# EasyEDA Pro project ED2025_-07-28_14-39-40.eprj

# Schematic Schematic1
Board Name: Board1; Create Date: 2025-07-28; Page Name: P1; Project Name: ED2025_-07-28_14-39-40; Schematic Name: Schematic1; Update Date: 2025-07-28; Company: 嘉立创EDA; Page Size: A4; Version: V1.0
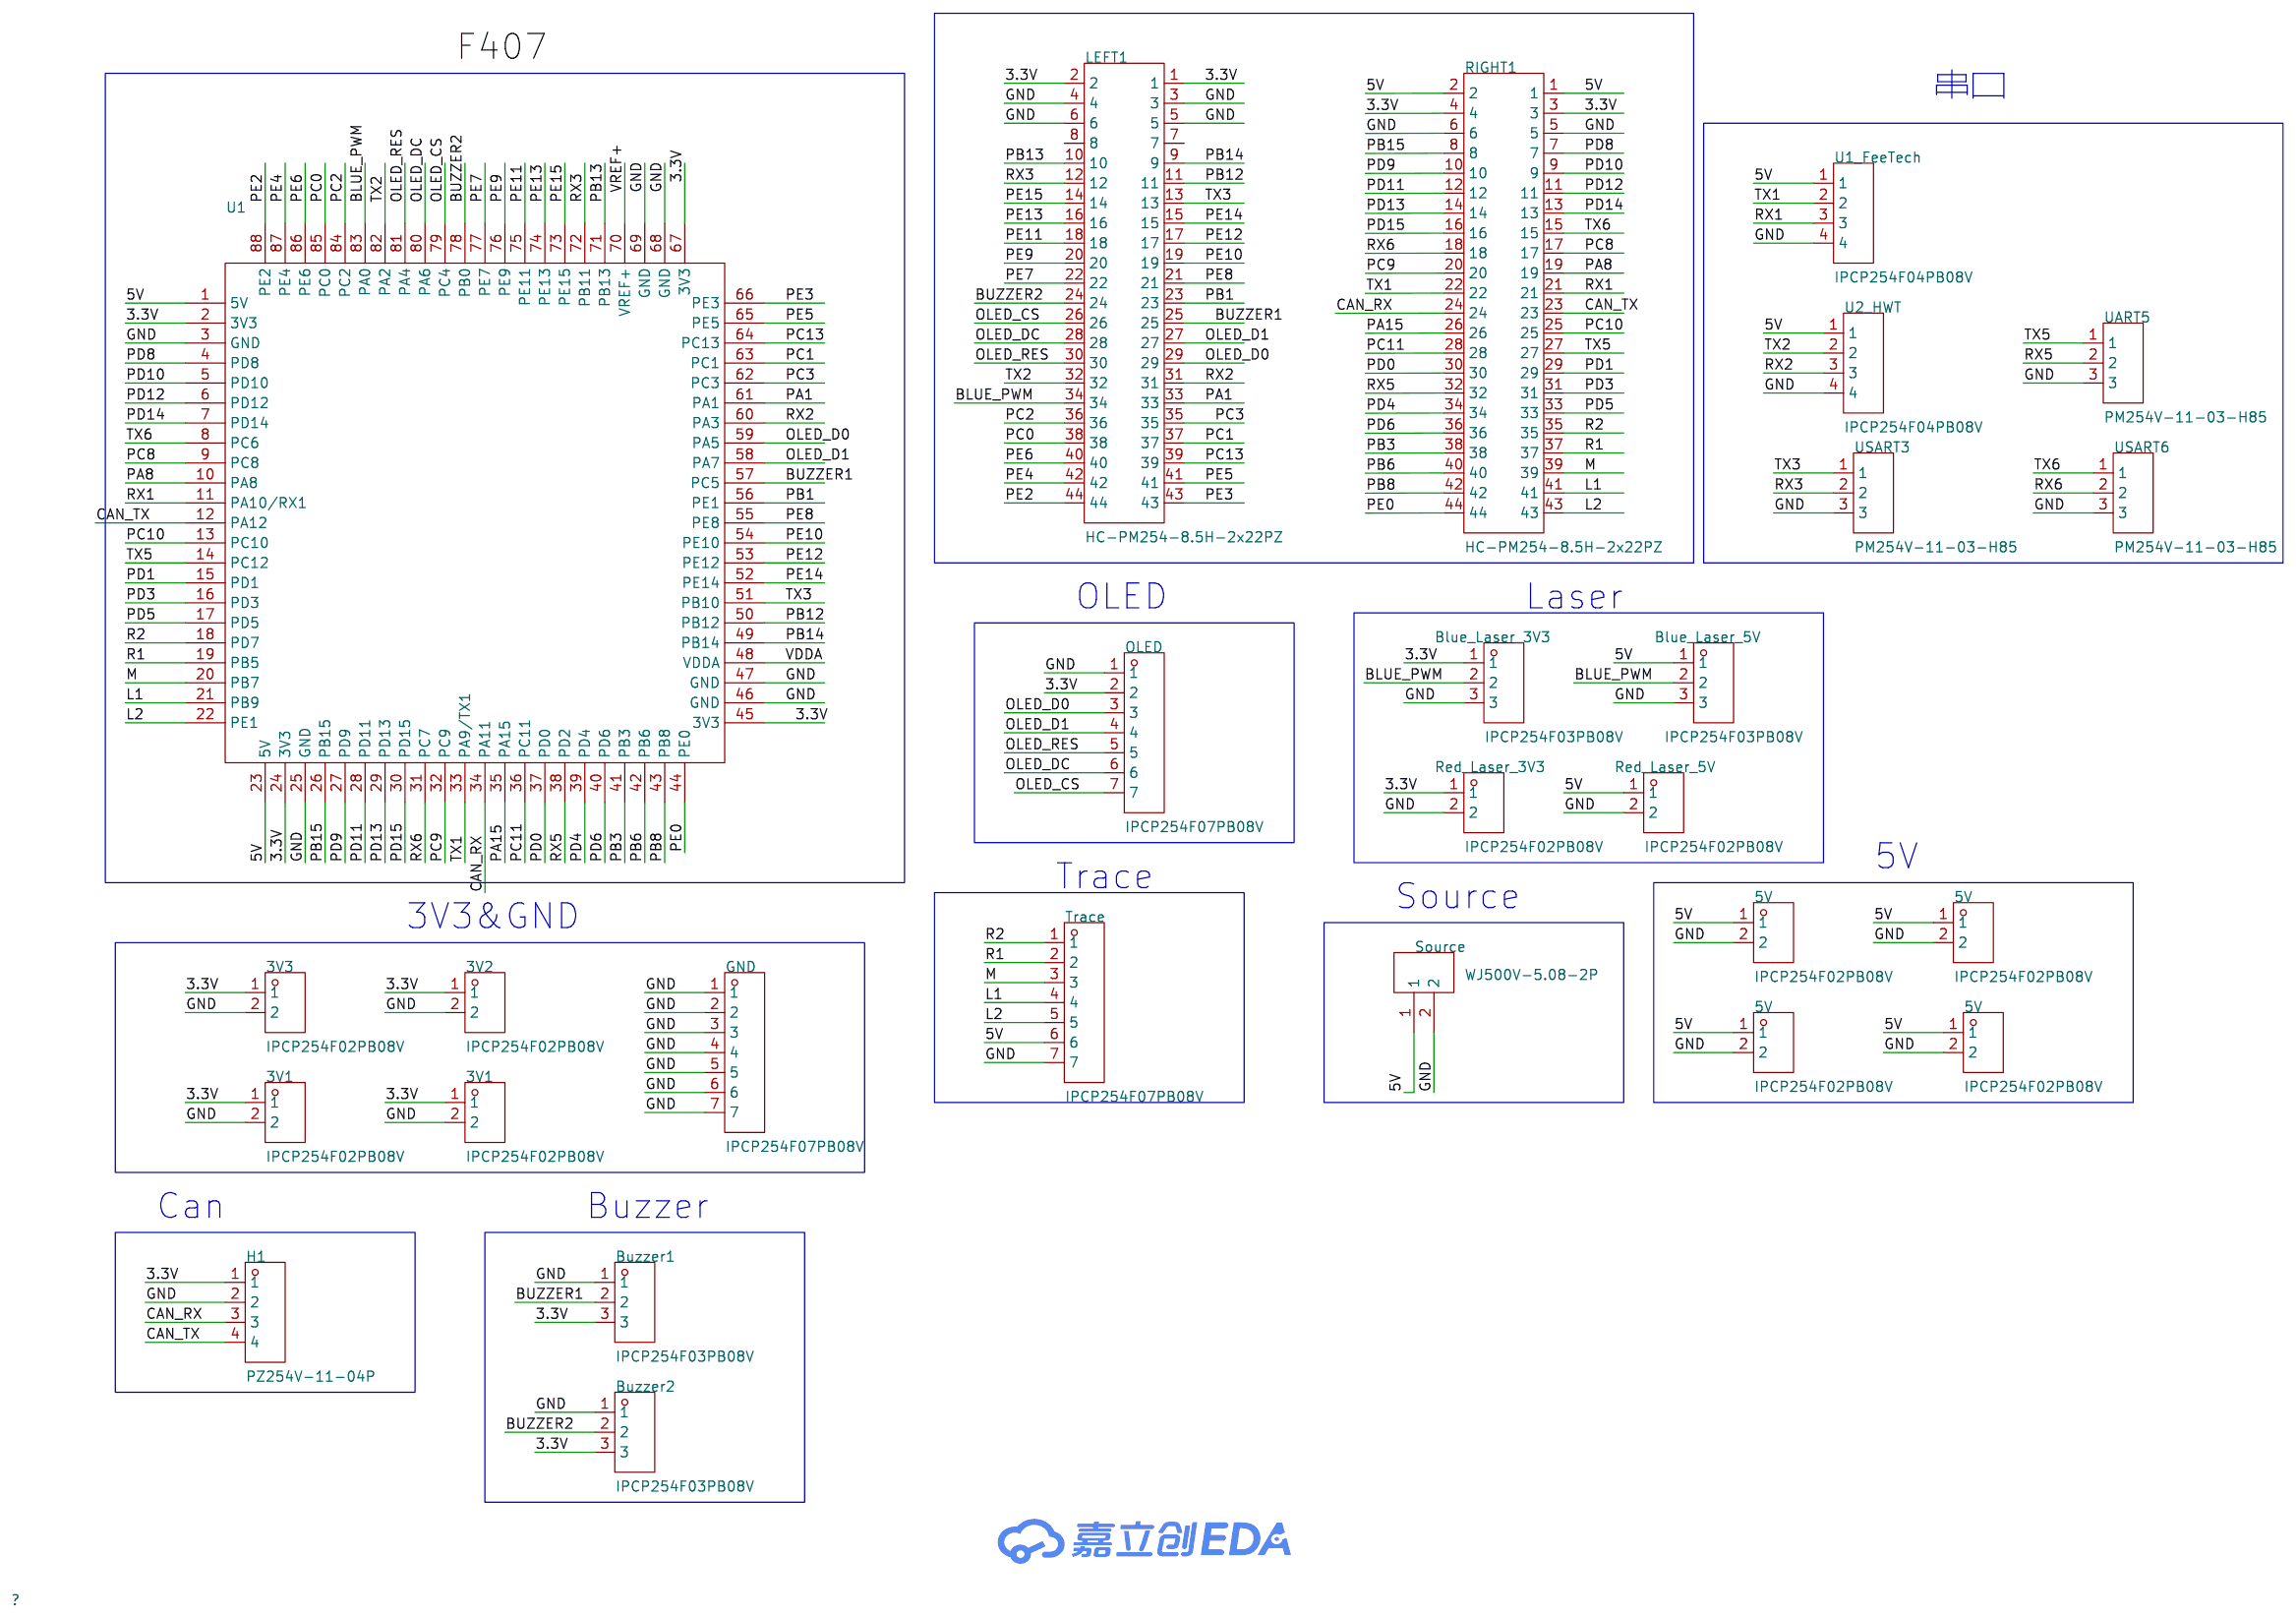
[diagram p0: schematic sheet]

## Parts
3V1  IPCP254F02PB08V  [CONN-TH_IPCP254F02PB08V]
3V1#2  IPCP254F02PB08V  [CONN-TH_IPCP254F02PB08V]
3V2  IPCP254F02PB08V  [CONN-TH_IPCP254F02PB08V]
3V3  IPCP254F02PB08V  [CONN-TH_IPCP254F02PB08V]
5V  IPCP254F02PB08V  [CONN-TH_IPCP254F02PB08V]
5V#2  IPCP254F02PB08V  [CONN-TH_IPCP254F02PB08V]
5V#3  IPCP254F02PB08V  [CONN-TH_IPCP254F02PB08V]
5V#4  IPCP254F02PB08V  [CONN-TH_IPCP254F02PB08V]
Blue_Laser_3V3  IPCP254F03PB08V  [HDR-TH_3P-P2.54-V-F-1]
Blue_Laser_5V  IPCP254F03PB08V  [HDR-TH_3P-P2.54-V-F-1]
Buzzer1  IPCP254F03PB08V  [HDR-TH_3P-P2.54-V-F-1]
Buzzer2  IPCP254F03PB08V  [HDR-TH_3P-P2.54-V-F-1]
GND  IPCP254F07PB08V  [HDR-TH_7P-P2.54-V-F]
H1  PZ254V-11-04P  [HDR-TH_4P-P2.54-V-M]
LEFT1  HC-PM254-8.5H-2x22PZ  [HDR-TH_44P-P2.54-V-F-R2-C22-S2.54]
OLED  IPCP254F07PB08V  [HDR-TH_7P-P2.54-V-F]
Red_Laser_3V3  IPCP254F02PB08V  [CONN-TH_IPCP254F02PB08V]
Red_Laser_5V  IPCP254F02PB08V  [CONN-TH_IPCP254F02PB08V]
RIGHT1  HC-PM254-8.5H-2x22PZ  [HDR-TH_44P-P2.54-V-F-R2-C22-S2.54]
Source  WJ500V-5.08-2P  [CONN-TH_2P-P5.00_WJ500V-5.08-2P]
Trace  IPCP254F07PB08V  [HDR-TH_7P-P2.54-V-F]
U1  -  [STM32F4XX最小系统板]
U1_FeeTech  IPCP254F04PB08V  [HDR-TH_4P-IPCP254F04PB08V]
U2_HWT  IPCP254F04PB08V  [HDR-TH_4P-IPCP254F04PB08V]
UART5  PM254V-11-03-H85  [HDR-TH_3P-P2.54-V-F]
USART3  PM254V-11-03-H85  [HDR-TH_3P-P2.54-V-F]
USART6  PM254V-11-03-H85  [HDR-TH_3P-P2.54-V-F]

## Library data of the parts
3V1 3V1#2 3V2 3V3 5V 5V#2-5V#4 Red_Laser_3V3 Red_Laser_5V = IPCP254F02PB08V: LCSC Part Name: 1x2P 间距:2.54mm 直插; Supplier Part: C22438460; Manufacturer: INCP; Supplier Footprint: 插件,P=2.54mm; JLCPCB Part Class: 扩展库; Datasheet: https://atta.szlcsc.com/upload/public/pdf/source/20240523/6A36805F5B2B6DF79759E177043CFD1C.pdf; Supplier: LCSC; Holes Structure: 1x2P; Pitch: 2.54mm; Circular Hole / Square Hole: 方孔; Mounting Type: 直插; Number of Rows: 单排; Number of Holes: 2P; Current Rating (Max): 3A; Insulation Height: 8.5mm; Contact Material: 黄铜; Contact Plating: 金; Operating Temperature Range: -40℃~+105℃
Blue_Laser_3V3 Blue_Laser_5V Buzzer1 Buzzer2 = IPCP254F03PB08V: LCSC Part Name: 1x3P 间距:2.54mm 直插; Supplier Part: C22438461; Manufacturer: INCP; Supplier Footprint: 插件,P=2.54mm; JLCPCB Part Class: 扩展库; Datasheet: https://atta.szlcsc.com/upload/public/pdf/source/20240523/6A36805F5B2B6DF79759E177043CFD1C.pdf; Supplier: LCSC; Holes Structure: 1x3P; Pitch: 2.54mm; Circular Hole / Square Hole: 方孔; Mounting Type: 直插; Number of Rows: 单排; Number of Holes: 3P; Current Rating (Max): 3A; Insulation Height: 8.5mm; Contact Material: 黄铜; Contact Plating: 金; Operating Temperature Range: -40℃~+105℃
GND OLED Trace = IPCP254F07PB08V: LCSC Part Name: 1x7P 间距:2.54mm 直插; Supplier Part: C22438465; Manufacturer: INCP; Supplier Footprint: 插件,P=2.54mm; JLCPCB Part Class: 扩展库; Datasheet: https://atta.szlcsc.com/upload/public/pdf/source/20240523/6A36805F5B2B6DF79759E177043CFD1C.pdf; Supplier: LCSC; Holes Structure: 1x7P; Pitch: 2.54mm; Circular Hole / Square Hole: 方孔; Mounting Type: 直插; Number of Rows: 单排; Number of Holes: 7P; Current Rating (Max): 3A; Insulation Height: 8.5mm; Contact Material: 黄铜; Contact Plating: 金; Operating Temperature Range: -40℃~+105℃
H1 = PZ254V-11-04P: LCSC Part Name: 间距:2.54mm 1x4P 直插 方针; Supplier Part: C2691448; Manufacturer: XFCN(兴飞); Supplier Footprint: 插件,P=2.54mm; JLCPCB Part Class: 扩展库; Datasheet: https://atta.szlcsc.com/upload/public/pdf/source/20200309/C492403_F9F19131791D08044AD4F84F8E751A34.pdf; Supplier: LCSC; Pin Structure: 1x4P; Pitch: 2.54mm; Circluar Pins/Square Pins: 方针; Mounting Type: 直插; Number of Rows: 单排; Number of Pins: 4P; Current Rating (Max): 3A; Voltage Rating (Max): 250V; Length of Mating Pin: 6mm; Insulation Height: 2.5mm; Length of End Connection Pin: 3mm; Operating Temperature Range: -40℃~+105℃; Color: 黑色
LEFT1 RIGHT1 = HC-PM254-8.5H-2x22PZ: LCSC Part Name: 间距2.54mm 2x22Pin 直插 PC3.0 H8.5; Supplier Part: C27985237; Manufacturer: HC(虹成电子); Supplier Footprint: 插件,P=2.54mm; JLCPCB Part Class: 扩展库; Datasheet: https://atta.szlcsc.com/upload/public/pdf/source/20250106/5A665511CCA213F356EEEBF322FAE788.pdf; Supplier: LCSC; Holes Structure: 2x22P; Pitch: 2.54mm; Row Spacing: 2.54mm; Circular Hole / Square Hole: 方孔; Mounting Type: 直插; Number of Rows: 双排; Number of Positions: 44P; Current Rating: 3A; Holes Direction: 顶部; Insulation Height: 8.5mm; Contact Material: 黄铜; Contact Plating: 金; Operating Temperature: -40℃~+105℃; PIN Length: 3mm
Source = WJ500V-5.08-2P: LCSC Part Name: 1x2P 5.08mm 直插 排数:1 每排P数:2; Supplier Part: C8465; Manufacturer: KANGNEX(康奈克斯电气); Supplier Footprint: 插件,P=5.08mm; JLCPCB Part Class: 扩展库; Datasheet: https://atta.szlcsc.com/upload/public/pdf/source/20191225/C8465_02D34CE5B5B4A53DF5891601D97FA9F4.pdf; Supplier: LCSC; Structure: 1x2P; Pitch: 5.08mm; Color: 绿色; Mounting Style: 直插; Current Rating (Max): 18A; Voltage Rating (Max): 250V; Number of Pins: 2P; Number of Rows: 1; Wire Gauge - AWG: 14~30; Wire Gauge - mm2: 2.5; Number of PINs Per Row: 2; Operating Temperature Range: -40℃~+105℃; Screw Specification: M2.5
U1 = STM32F4xx 最小系统板
U1_FeeTech U2_HWT = IPCP254F04PB08V: LCSC Part Name: 1x4P 间距:2.54mm 直插; Supplier Part: C22438462; Manufacturer: INCP; Supplier Footprint: 插件,P=2.54mm; JLCPCB Part Class: 扩展库; Datasheet: https://atta.szlcsc.com/upload/public/pdf/source/20240523/6A36805F5B2B6DF79759E177043CFD1C.pdf; Supplier: LCSC; Holes Structure: 1x4P; Pitch: 2.54mm; Circular Hole / Square Hole: 方孔; Mounting Type: 直插; Number of Rows: 单排; Number of Positions: 4P; Current Rating: 3A; Insulation Height: 8.5mm; Contact Material: 黄铜; Contact Plating: 金; Operating Temperature: -40℃~+105℃
UART5 USART3 USART6 = PM254V-11-03-H85: LCSC Part Name: 间距:2.54mm 1x3P 直插; Supplier Part: C541850; Manufacturer: XFCN(兴飞); Supplier Footprint: 插件,P=2.54mm; JLCPCB Part Class: 扩展库; Datasheet: https://atta.szlcsc.com/upload/public/pdf/source/20200518/C541849_85853D71FC67C51915A806977A588FDA.pdf; Supplier: LCSC; Holes Structure: 1x3P; Pitch: 2.54mm; Mounting Type: 直插; Number of Rows: 单排; Number of Holes: 3P; Contact Material: 黄铜

## Nets
3.3V: 3V1.1 3V1#2.1 3V2.1 3V3.1 Blue_Laser_3V3.1 Buzzer1.3 Buzzer2.3 H1.1 LEFT1.1 LEFT1.2 OLED.2 Red_Laser_3V3.1 RIGHT1.3 RIGHT1.4 U1.2(3V3) U1.24(3V3) U1.45(3V3) U1.67(3V3)
5V: 5V.1 5V#2.1 5V#3.1 5V#4.1 Blue_Laser_5V.1 Red_Laser_5V.1 RIGHT1.1 RIGHT1.2 Source.1 Trace.6 U1.1(5V) U1.23(5V) U1_FeeTech.1 U2_HWT.1
GND: 3V1.2 3V1#2.2 3V2.2 3V3.2 5V.2 5V#2.2 5V#3.2 5V#4.2 Blue_Laser_3V3.3 Blue_Laser_5V.3 Buzzer1.1 Buzzer2.1 GND.1 GND.2 GND.3 GND.4 GND.5 GND.6 GND.7 H1.2 LEFT1.3 LEFT1.4 LEFT1.5 LEFT1.6 OLED.1 Red_Laser_3V3.2 Red_Laser_5V.2 RIGHT1.5 RIGHT1.6 Source.2 Trace.7 U1.3(GND) U1.25(GND) U1.46(GND) U1.47(GND) U1.68(GND) U1.69(GND) U1_FeeTech.4 U2_HWT.4 UART5.3 USART3.3 USART6.3
VDDA: U1.48(VDDA)
BLUE_PWM: Blue_Laser_3V3.2 Blue_Laser_5V.2 LEFT1.34 U1.83(PA0)
BUZZER1: Buzzer1.2 LEFT1.25 U1.57(PC5)
BUZZER2: Buzzer2.2 LEFT1.24 U1.78(PB0)
CAN_RX: H1.3 RIGHT1.24 U1.34(PA11)
CAN_TX: H1.4 RIGHT1.23 U1.12(PA12)
L1: RIGHT1.41 Trace.4 U1.21(PB9)
L2: RIGHT1.43 Trace.5 U1.22(PE1)
M: RIGHT1.39 Trace.3 U1.20(PB7)
OLED_CS: LEFT1.26 OLED.7 U1.79(PC4)
OLED_D0: LEFT1.29 OLED.3 U1.59(PA5)
OLED_D1: LEFT1.27 OLED.4 U1.58(PA7)
OLED_DC: LEFT1.28 OLED.6 U1.80(PA6)
OLED_RES: LEFT1.30 OLED.5 U1.81(PA4)
PA1: LEFT1.33 U1.61(PA1)
PA8: RIGHT1.19 U1.10(PA8)
PA15: RIGHT1.26 U1.35(PA15)
PB1: LEFT1.23 U1.56(PE1)
PB3: RIGHT1.38 U1.41(PB3)
PB6: RIGHT1.40 U1.42(PB6)
PB8: RIGHT1.42 U1.43(PB8)
PB12: LEFT1.11 U1.50(PB12)
PB13: LEFT1.10 U1.71(PB13)
PB14: LEFT1.9 U1.49(PB14)
PB15: RIGHT1.8 U1.26(PB15)
PC0: LEFT1.38 U1.85(PC0)
PC1: LEFT1.37 U1.63(PC1)
PC2: LEFT1.36 U1.84(PC2)
PC3: LEFT1.35 U1.62(PC3)
PC8: RIGHT1.17 U1.9(PC8)
PC9: RIGHT1.20 U1.32(PC9)
PC10: RIGHT1.25 U1.13(PC10)
PC11: RIGHT1.28 U1.36(PC11)
PC13: LEFT1.39 U1.64(PC13)
PD0: RIGHT1.30 U1.37(PD0)
PD1: RIGHT1.29 U1.15(PD1)
PD3: RIGHT1.31 U1.16(PD3)
PD4: RIGHT1.34 U1.39(PD4)
PD5: RIGHT1.33 U1.17(PD5)
PD6: RIGHT1.36 U1.40(PD6)
PD8: RIGHT1.7 U1.4(PD8)
PD9: RIGHT1.10 U1.27(PD9)
PD10: RIGHT1.9 U1.5(PD10)
PD11: RIGHT1.12 U1.28(PD11)
PD12: RIGHT1.11 U1.6(PD12)
PD13: RIGHT1.14 U1.29(PD13)
PD14: RIGHT1.13 U1.7(PD14)
PD15: RIGHT1.16 U1.30(PD15)
PE0: RIGHT1.44 U1.44(PE0)
PE2: LEFT1.44 U1.88(PE2)
PE3: LEFT1.43 U1.66(PE3)
PE4: LEFT1.42 U1.87(PE4)
PE5: LEFT1.41 U1.65(PE5)
PE6: LEFT1.40 U1.86(PE6)
PE7: LEFT1.22 U1.77(PE7)
PE8: LEFT1.21 U1.55(PE8)
PE9: LEFT1.20 U1.76(PE9)
PE10: LEFT1.19 U1.54(PE10)
PE11: LEFT1.18 U1.75(PE11)
PE12: LEFT1.17 U1.53(PE12)
PE13: LEFT1.16 U1.74(PE13)
PE14: LEFT1.15 U1.52(PE14)
PE15: LEFT1.14 U1.73(PE15)
R1: RIGHT1.37 Trace.2 U1.19(PB5)
R2: RIGHT1.35 Trace.1 U1.18(PD7)
RX1: RIGHT1.21 U1.11(PA10/RX1) U1_FeeTech.3
RX2: LEFT1.31 U1.60(PA3) U2_HWT.3
RX3: LEFT1.12 U1.72(PB11) USART3.2
RX5: RIGHT1.32 U1.38(PD2) UART5.2
RX6: RIGHT1.18 U1.31(PC7) USART6.2
TX1: RIGHT1.22 U1.33(PA9/TX1) U1_FeeTech.2
TX2: LEFT1.32 U1.82(PA2) U2_HWT.2
TX3: LEFT1.13 U1.51(PB10) USART3.1
TX5: RIGHT1.27 U1.14(PC12) UART5.1
TX6: RIGHT1.15 U1.8(PC6) USART6.1
VREF+: U1.70(VREF+)

Not connected (* = marked no-connect by the designer): LEFT1 7 8

## Notes on the sheet
- F407
- 串口
- OLED
- Laser
- 5V
- Trace
- 3V3&GND
- Source
- Can
- Buzzer

# Board PCB1
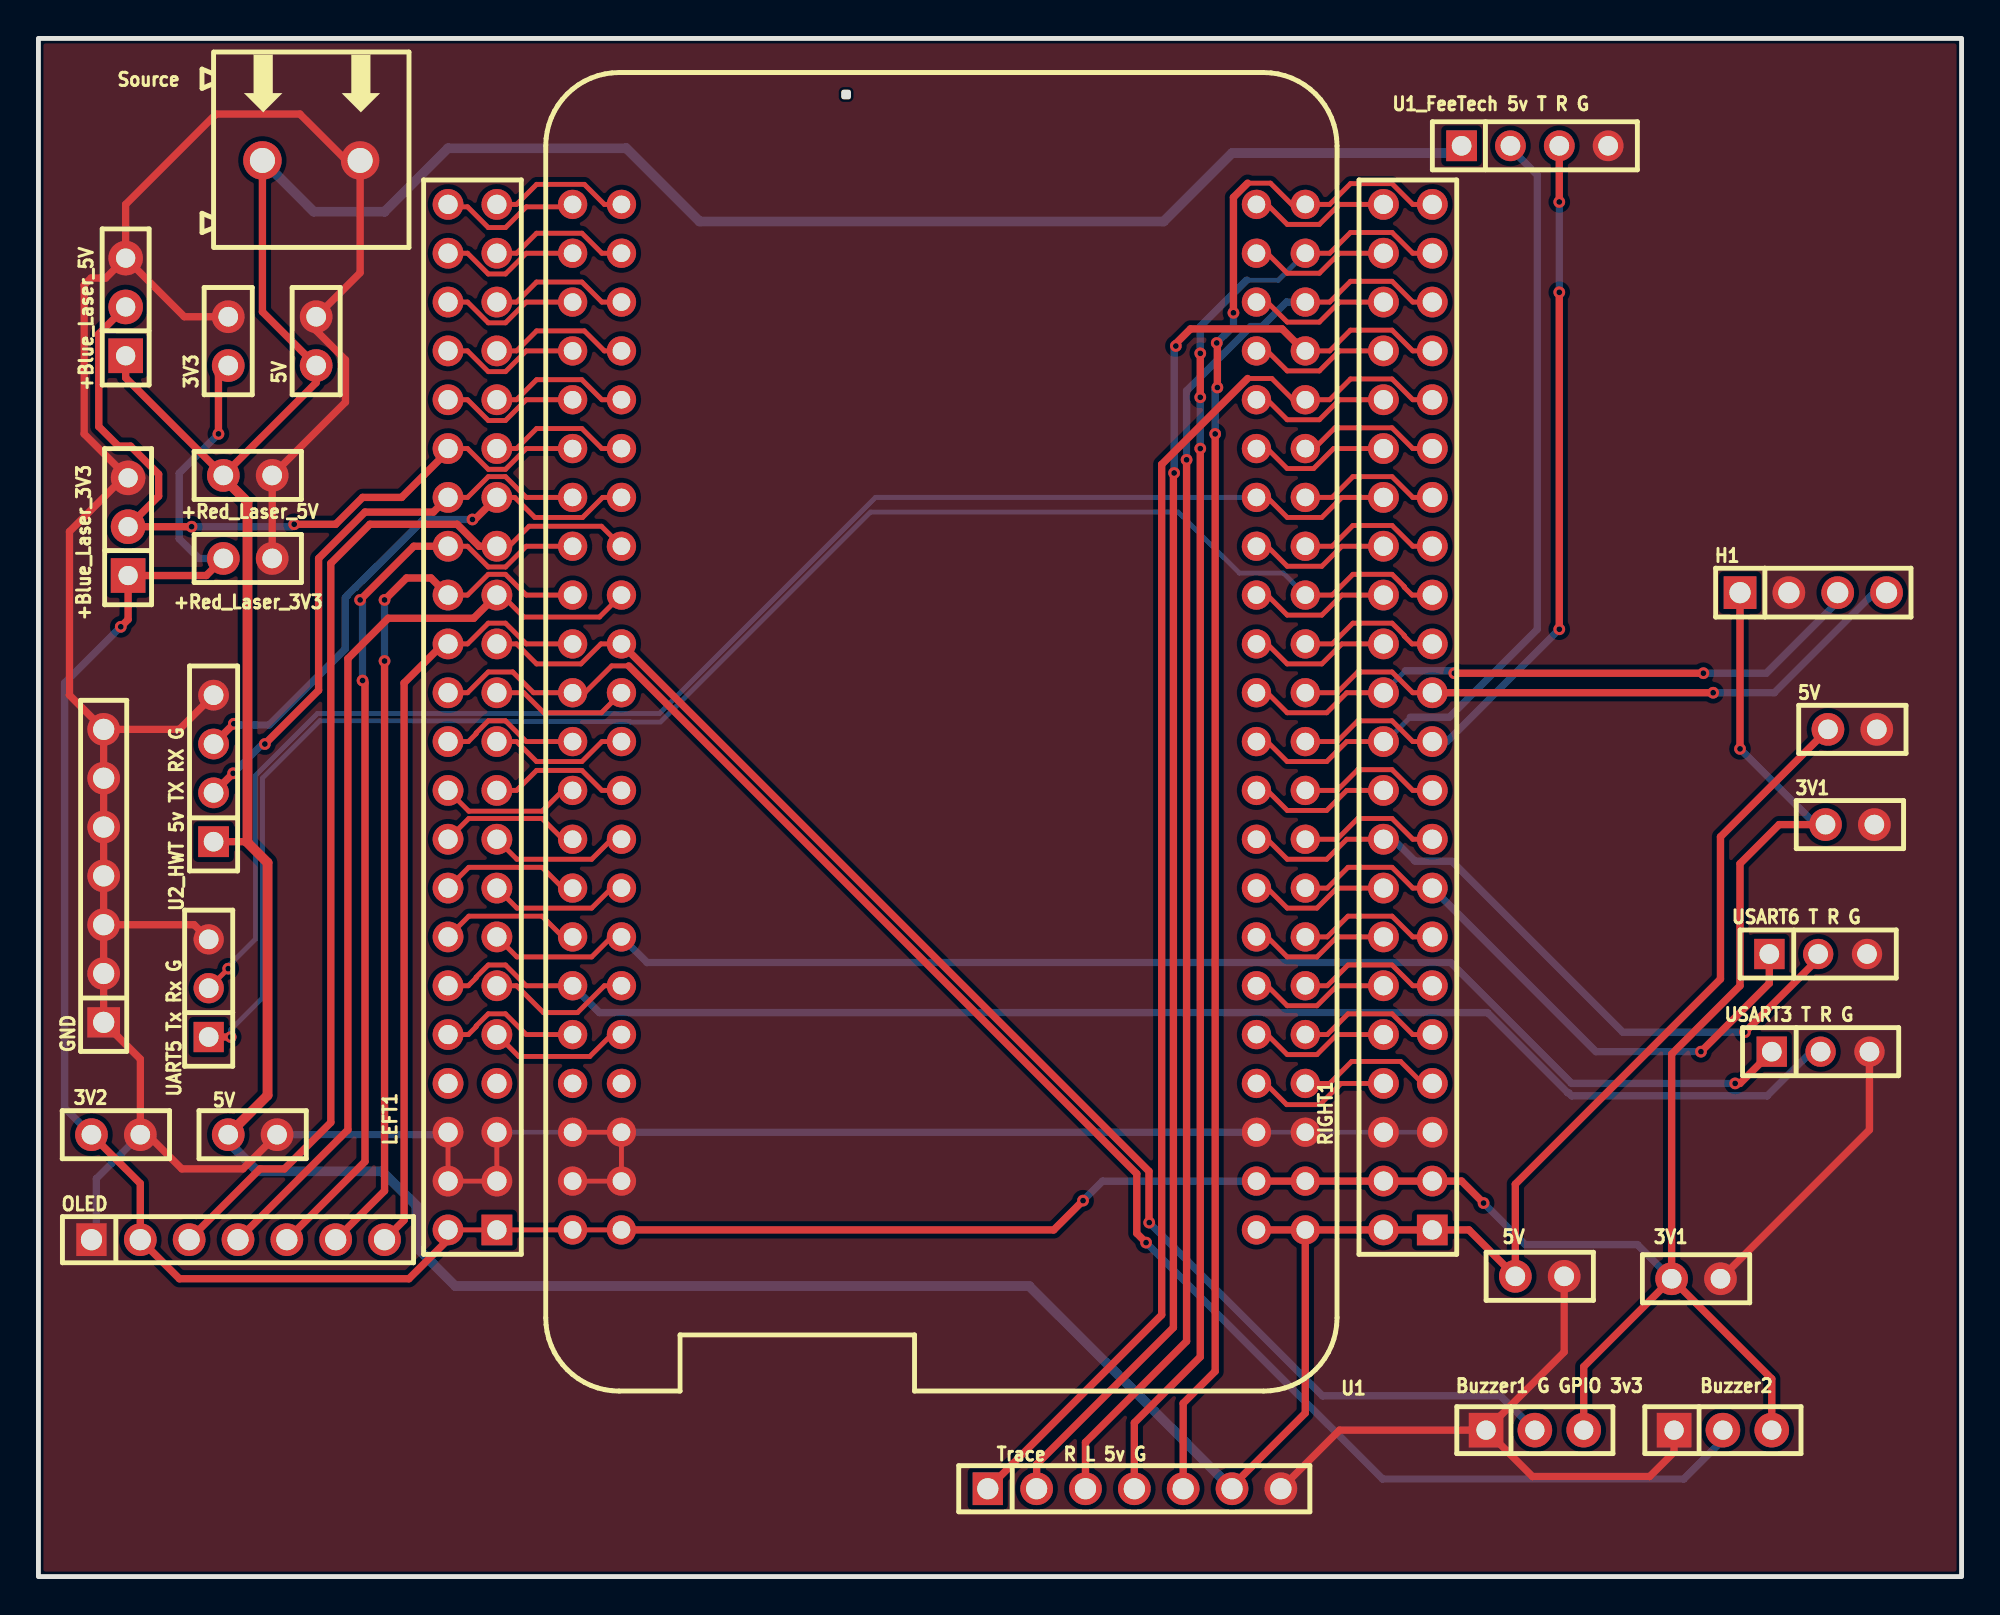
[diagram p1: board, top side]
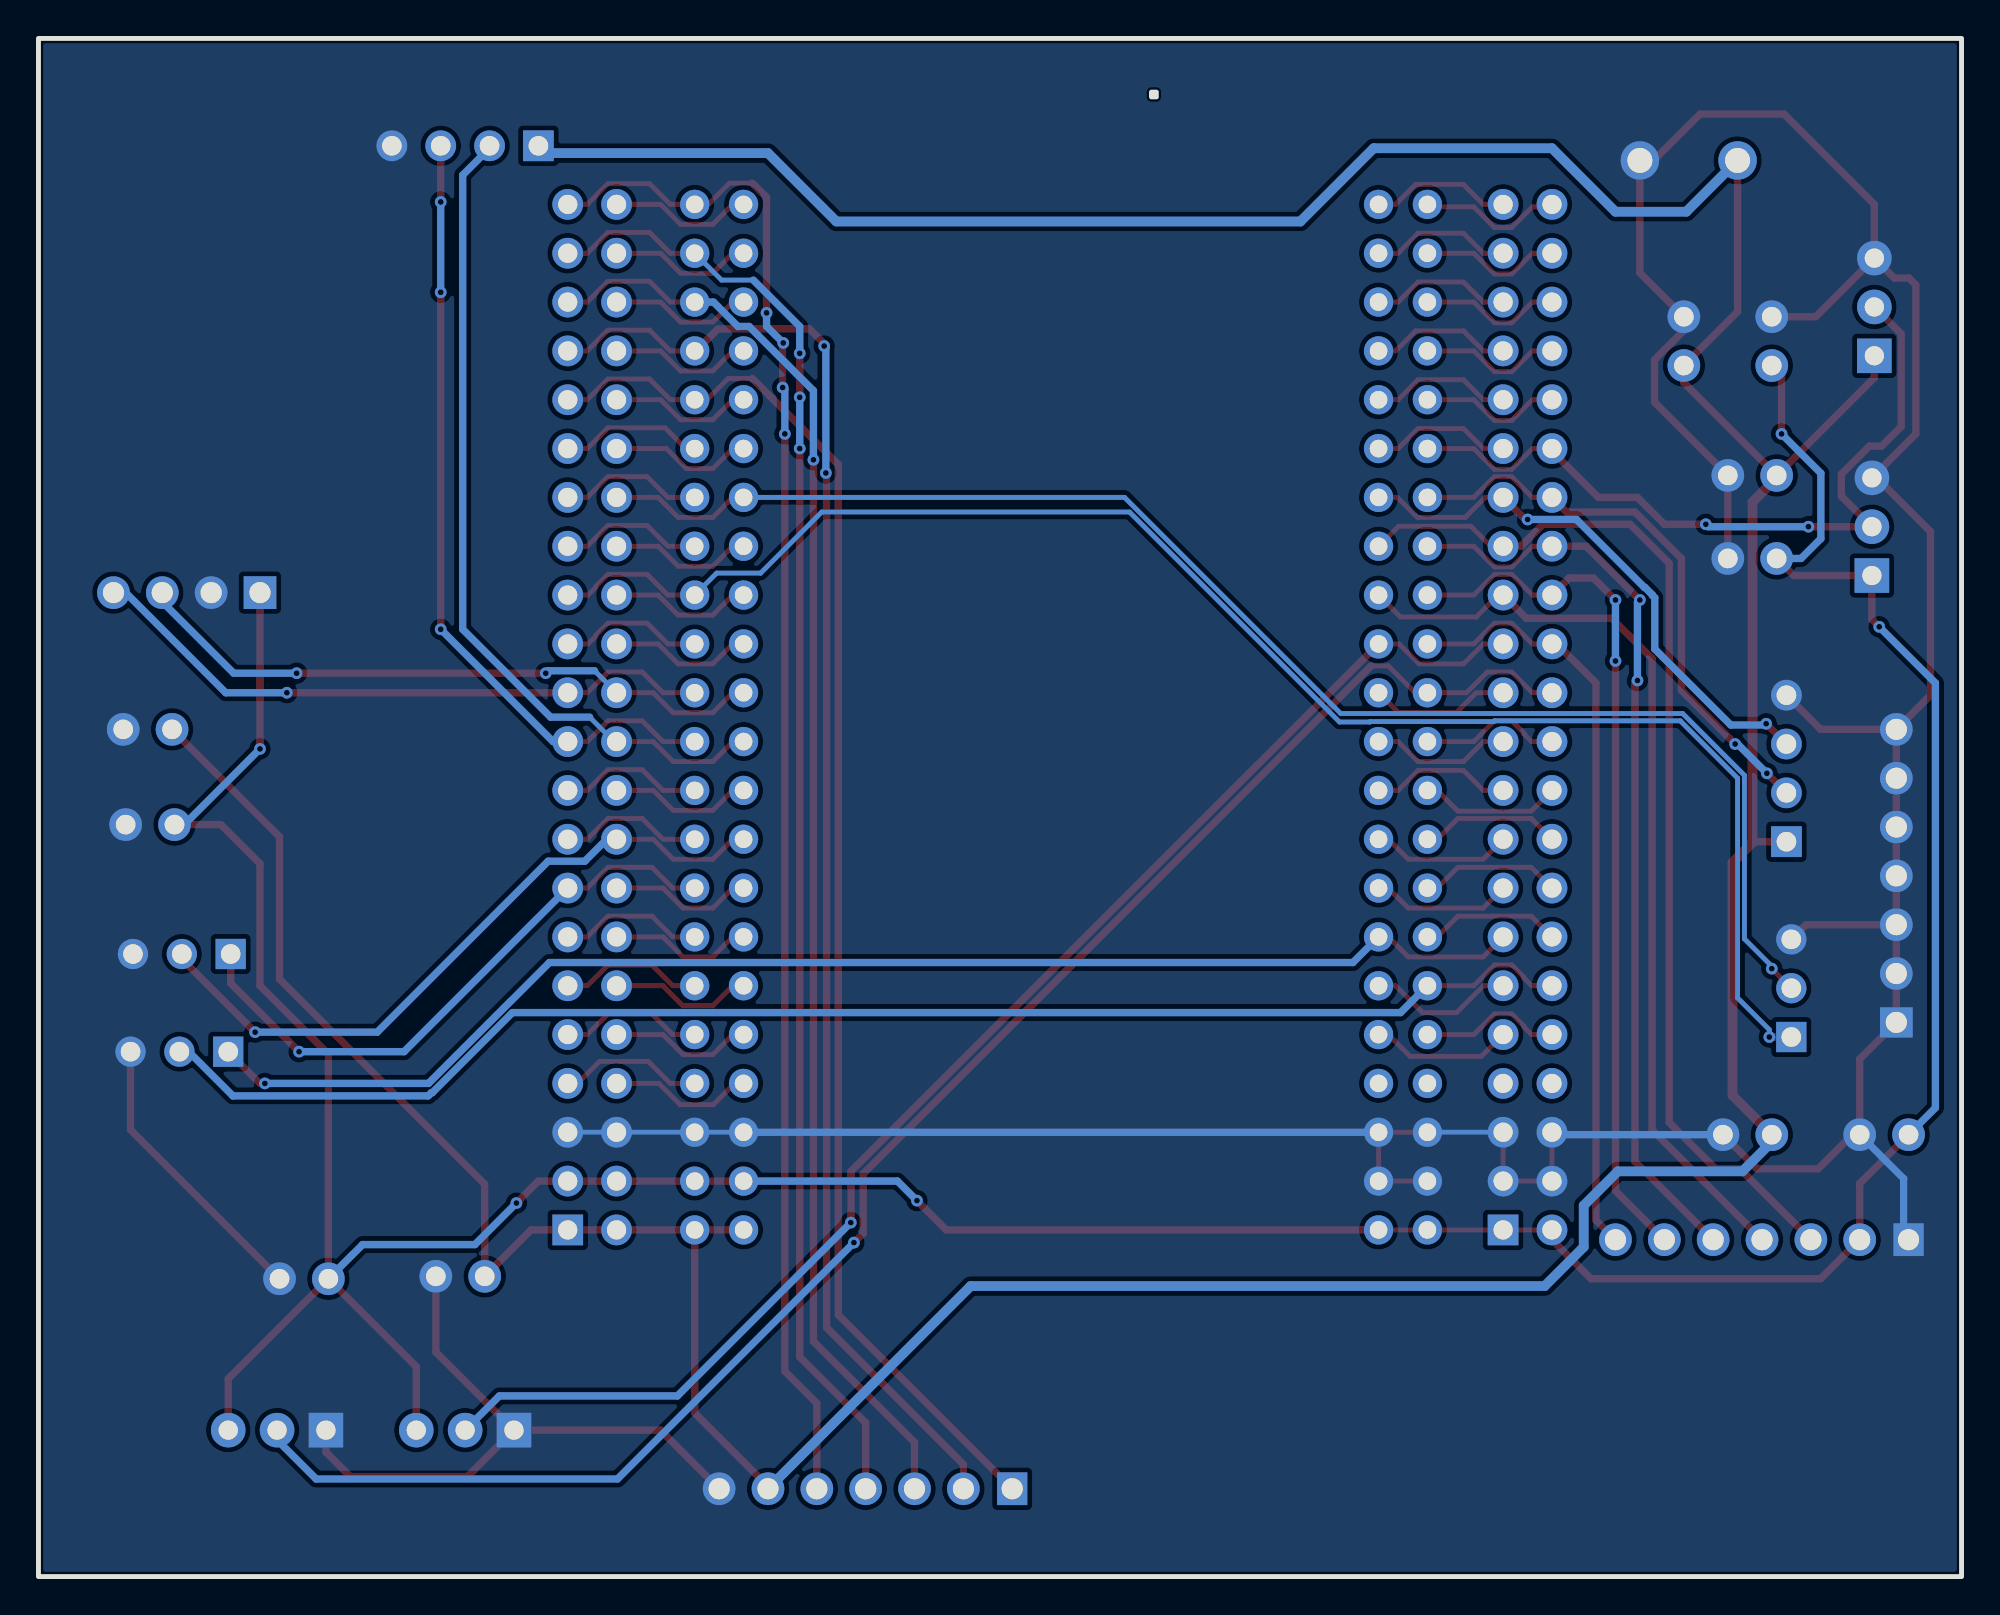
[diagram p2: board, bottom side, seen from below]

Outline 100 x 80 mm; copper layers: Top Layer, Bottom Layer. Coordinates in mm from the lower left corner of the outline.
Outline path: rectangle 0,80 100,0 ; rectangle 41.87,77.21 42.13,76.96
Stack: Top Layer 0.035mm / Dielectric1 1.51mm FR4 er 4.5 / Bottom Layer 0.035mm

## Design rules (mm)
template: 自定义配置
spacing copperThickness1oz (default): track to track 0.102, other pairs 0.152 to 0.3
spacing copperThickness2oz: track to track 0.203, other pairs 0.152 to 0.3
track width copperThickness1oz (default): min 0.127, default 0.254, max 2.54
track width copperThickness2oz: min 0.203, default 0.254, max 2.54
differential pair differentialPair (default): width min 0.127, default 0.254, max 2.54; gap min 0.152, default 0.152
via viaSize (default): diameter min 0.5, default 0.61, max 10; hole min 0.3, default 0.305, max 6.3

## Placement (name value [footprint] x y rotation side)
3V1  IPCP254F02PB08V  [CONN-TH_IPCP254F02PB08V]  86.19 15.49 0 top
3V1#2  IPCP254F02PB08V  [CONN-TH_IPCP254F02PB08V]  94.2 39.11 0 top
3V2  IPCP254F02PB08V  [CONN-TH_IPCP254F02PB08V]  4.03 22.98 0 top
3V3  IPCP254F02PB08V  [CONN-TH_IPCP254F02PB08V]  9.87 64.26 90 top
5V  IPCP254F02PB08V  [CONN-TH_IPCP254F02PB08V]  11.14 22.98 0 top
5V#2  IPCP254F02PB08V  [CONN-TH_IPCP254F02PB08V]  78.07 15.62 0 top
5V#3  IPCP254F02PB08V  [CONN-TH_IPCP254F02PB08V]  14.44 64.26 90 top
5V#4  IPCP254F02PB08V  [CONN-TH_IPCP254F02PB08V]  94.32 44.06 0 top
+Blue_Laser_3V3  IPCP254F03PB08V  [HDR-TH_3P-P2.54-V-F-1]  4.66 54.61 90 top
+Blue_Laser_5V  IPCP254F03PB08V  [HDR-TH_3P-P2.54-V-F-1]  4.53 66.03 90 top
+Red_Laser_3V3  IPCP254F02PB08V  [CONN-TH_IPCP254F02PB08V]  10.88 52.95 0 top
+Red_Laser_5V  IPCP254F02PB08V  [CONN-TH_IPCP254F02PB08V]  10.88 57.27 0 top
Buzzer1 G GPIO 3v3  IPCP254F03PB08V  [HDR-TH_3P-P2.54-V-F-1]  77.81 7.62 0 top
Buzzer2  IPCP254F03PB08V  [HDR-TH_3P-P2.54-V-F-1]  87.59 7.62 0 top
GND  IPCP254F07PB08V  [HDR-TH_7P-P2.54-V-F]  3.39 36.44 90 top
H1  PZ254V-11-04P  [HDR-TH_4P-P2.54-V-M]  92.29 51.18 0 top
LEFT1  HC-PM254-8.5H-2x22PZ  [HDR-TH_44P-P2.54-V-F-R2-C22-S2.54]  22.57 44.7 90 top
OLED  IPCP254F07PB08V  [HDR-TH_7P-P2.54-V-F]  10.38 17.52 0 top
RIGHT1  HC-PM254-8.5H-2x22PZ  [HDR-TH_44P-P2.54-V-F-R2-C22-S2.54]  71.21 44.7 90 top
Source  WJ500V-5.08-2P  [CONN-TH_2P-P5.00_WJ500V-5.08-2P]  14.19 73.66 0 top
Trace  R L 5v G  -  [HDR-TH_7P-P2.54-V-F]  56.99 4.57 0 top
U1  -  [STM32F4XX最小系统板]  65.88 18.03 180 top
U1_FeeTech 5v T R G  IPCP254F04PB08V  [HDR-TH_4P-IPCP254F04PB08V]  77.81 74.42 0 top
U2_HWT 5v TX RX G  IPCP254F04PB08V  [HDR-TH_4P-IPCP254F04PB08V]  9.11 42.03 90 top
UART5 Tx Rx G  PM254V-11-03-H85  [HDR-TH_3P-P2.54-V-F]  8.85 30.6 90 top
USART3 T R G  PM254V-11-03-H85  [HDR-TH_3P-P2.54-V-F]  92.67 27.3 0 top
USART6 T R G  PM254V-11-03-H85  [HDR-TH_3P-P2.54-V-F]  92.54 32.38 0 top

## Footprints (pads in the part's own frame, mm; a bottom-side part is the same pattern mirrored in y, then rotated)
CONN-TH_2P-P5.00_WJ500V-5.08-2P
  round 2 hole 1.3: 1(-2.54,0) 2(2.54,0)
CONN-TH_IPCP254F02PB08V
  round 1.7 hole 1.02: 1(-1.27,0) 2(1.27,0)
HDR-TH_3P-P2.54-V-F
  rect 1.575x1.575 hole 1.02: 1(-2.54,0)
  round 1.575 hole 1.02: 2(0,0) 3(2.54,0)
HDR-TH_3P-P2.54-V-F-1
  rect 1.8x1.8 hole 1: 1(-2.54,0)
  round 1.8 hole 1: 2(0,0) 3(2.54,0)
HDR-TH_4P-IPCP254F04PB08V
  rect 1.6x1.6 hole 1.02: 1(-3.81,0)
  round 1.6 hole 1.02: 2(-1.27,0) 3(1.27,0) 4(3.81,0)
HDR-TH_4P-P2.54-V-M
  rect 1.7x1.7 hole 1.1: 1(-3.81,0)
  round 1.7 hole 1.1: 2(-1.27,0) 3(1.27,0) 4(3.81,0)
HDR-TH_7P-P2.54-V-F
  rect 1.575x1.7 hole 1.1: 1(-7.62,0)
  round 1.7 hole 1.1: 2(-5.08,0) 3(-2.54,0) 4(0,0) 5(2.54,0) 6(5.08,0) 7(7.62,0)
HDR-TH_44P-P2.54-V-F-R2-C22-S2.54
  rect 1.6x1.6 hole 1: 1(-26.67,-1.27)
  round 1.6 hole 1: 2(-26.67,1.27) 3(-24.13,-1.27) 4(-24.13,1.27) 5(-21.59,-1.27) 6(-21.59,1.27) 7(-19.05,-1.27) 8(-19.05,1.27) 9(-16.51,-1.27) 10(-16.51,1.27) 11(-13.97,-1.27) 12(-13.97,1.27) 13(-11.43,-1.27) 14(-11.43,1.27) 15(-8.89,-1.27) 16(-8.89,1.27) 17(-6.35,-1.27) 18(-6.35,1.27) 19(-3.81,-1.27) 20(-3.81,1.27) 21(-1.27,-1.27) 22(-1.27,1.27) 23(1.27,-1.27) 24(1.27,1.27) 25(3.81,-1.27) 26(3.81,1.27) 27(6.35,-1.27) 28(6.35,1.27) 29(8.89,-1.27) 30(8.89,1.27) 31(11.43,-1.27) 32(11.43,1.27) 33(13.97,-1.27) 34(13.97,1.27) 35(16.51,-1.27) 36(16.51,1.27) 37(19.05,-1.27) 38(19.05,1.27) 39(21.59,-1.27) 40(21.59,1.27) 41(24.13,-1.27) 42(24.13,1.27) 43(26.67,-1.27) 44(26.67,1.27)
STM32F4XX最小系统板
  round 1.524 hole 0.914: 1(0,0) 2(0,-2.54) 3(0,-5.08) 4(0,-7.62) 5(0,-10.16) 6(0,-12.7) 7(0,-15.24) 8(0,-17.78) 9(0,-20.32) 10(0,-22.86) 11(0,-25.4) 12(0,-27.94) 13(0,-30.48) 14(0,-33.02) 15(0,-35.56) 16(0,-38.1) 17(0,-40.64) 18(0,-43.18) 19(0,-45.72) 20(0,-48.26) 21(0,-50.8) 22(0,-53.34) 23(2.54,0) 24(2.54,-2.54) 25(2.54,-5.08) 26(2.54,-7.62) 27(2.54,-10.16) 28(2.54,-12.7) 29(2.54,-15.24) 30(2.54,-17.78) 31(2.54,-20.32) 32(2.54,-22.86) 33(2.54,-25.4) 34(2.54,-27.94) 35(2.54,-30.48) 36(2.54,-33.02) 37(2.54,-35.56) 38(2.54,-38.1) 39(2.54,-40.64) 40(2.54,-43.18) 41(2.54,-45.72) 42(2.54,-48.26) 43(2.54,-50.8) 44(2.54,-53.34) 45(35.56,0) 46(35.56,-2.54) 47(35.56,-5.08) 48(35.56,-7.62) 49(35.56,-10.16) 50(35.56,-12.7) 51(35.56,-15.24) 52(35.56,-17.78) 53(35.56,-20.32) 54(35.56,-22.86) 55(35.56,-25.4) 56(35.56,-27.94) 57(35.56,-30.48) 58(35.56,-33.02) 59(35.56,-35.56) 60(35.56,-38.1) 61(35.56,-40.64) 62(35.56,-43.18) 63(35.56,-45.72) 64(35.56,-48.26) 65(35.56,-50.8) 66(35.56,-53.34) 67(38.1,0) 68(38.1,-2.54) 69(38.1,-5.08) 70(38.1,-7.62) 71(38.1,-10.16) 72(38.1,-12.7) 73(38.1,-15.24) 74(38.1,-17.78) 75(38.1,-20.32) 76(38.1,-22.86) 77(38.1,-25.4) 78(38.1,-27.94) 79(38.1,-30.48) 80(38.1,-33.02) 81(38.1,-35.56) 82(38.1,-38.1) 83(38.1,-40.64) 84(38.1,-43.18) 85(38.1,-45.72) 86(38.1,-48.26) 87(38.1,-50.8) 88(38.1,-53.34)

## Nets
3.3V: 3V1.1 3V1#2.1 3V2.1 3V3.1 +Blue_Laser_3V3.1 +Red_Laser_3V3.1 Buzzer1 G GPIO 3v3.3 Buzzer2.3 H1.1 LEFT1.1 LEFT1.2 OLED.2 RIGHT1.3 RIGHT1.4 U1.2 U1.24 U1.45 U1.67
5V: 5V.1 5V#2.1 5V#3.1 5V#4.1 +Blue_Laser_5V.1 +Red_Laser_5V.1 RIGHT1.1 RIGHT1.2 Source.1 Trace  R L 5v G.6 U1.1 U1.23 U1_FeeTech 5v T R G.1 U2_HWT 5v TX RX G.1
GND: 3V1.2 3V1#2.2 3V2.2 3V3.2 5V.2 5V#2.2 5V#3.2 5V#4.2 +Blue_Laser_3V3.3 +Blue_Laser_5V.3 +Red_Laser_3V3.2 +Red_Laser_5V.2 Buzzer1 G GPIO 3v3.1 Buzzer2.1 GND.1 GND.2 GND.3 GND.4 GND.5 GND.6 GND.7 H1.2 LEFT1.3 LEFT1.4 LEFT1.5 LEFT1.6 OLED.1 RIGHT1.5 RIGHT1.6 Source.2 Trace  R L 5v G.7 U1.3 U1.25 U1.46 U1.47 U1.68 U1.69 U1_FeeTech 5v T R G.4 U2_HWT 5v TX RX G.4 UART5 Tx Rx G.3 USART3 T R G.3 USART6 T R G.3
VDDA: U1.48
BLUE_PWM: +Blue_Laser_3V3.2 +Blue_Laser_5V.2 LEFT1.34 U1.83
BUZZER1: Buzzer1 G GPIO 3v3.2 LEFT1.25 U1.57
BUZZER2: Buzzer2.2 LEFT1.24 U1.78
CAN_RX: H1.3 RIGHT1.24 U1.34
CAN_TX: H1.4 RIGHT1.23 U1.12
L1: RIGHT1.41 Trace  R L 5v G.4 U1.21
L2: RIGHT1.43 Trace  R L 5v G.5 U1.22
M: RIGHT1.39 Trace  R L 5v G.3 U1.20
OLED_CS: LEFT1.26 OLED.7 U1.79
OLED_D0: LEFT1.29 OLED.3 U1.59
OLED_D1: LEFT1.27 OLED.4 U1.58
OLED_DC: LEFT1.28 OLED.6 U1.80
OLED_RES: LEFT1.30 OLED.5 U1.81
PA1: LEFT1.33 U1.61
PA8: RIGHT1.19 U1.10
PA15: RIGHT1.26 U1.35
PB1: LEFT1.23 U1.56
PB3: RIGHT1.38 U1.41
PB6: RIGHT1.40 U1.42
PB8: RIGHT1.42 U1.43
PB12: LEFT1.11 U1.50
PB13: LEFT1.10 U1.71
PB14: LEFT1.9 U1.49
PB15: RIGHT1.8 U1.26
PC0: LEFT1.38 U1.85
PC1: LEFT1.37 U1.63
PC2: LEFT1.36 U1.84
PC3: LEFT1.35 U1.62
PC8: RIGHT1.17 U1.9
PC9: RIGHT1.20 U1.32
PC10: RIGHT1.25 U1.13
PC11: RIGHT1.28 U1.36
PC13: LEFT1.39 U1.64
PD0: RIGHT1.30 U1.37
PD1: RIGHT1.29 U1.15
PD3: RIGHT1.31 U1.16
PD4: RIGHT1.34 U1.39
PD5: RIGHT1.33 U1.17
PD6: RIGHT1.36 U1.40
PD8: RIGHT1.7 U1.4
PD9: RIGHT1.10 U1.27
PD10: RIGHT1.9 U1.5
PD11: RIGHT1.12 U1.28
PD12: RIGHT1.11 U1.6
PD13: RIGHT1.14 U1.29
PD14: RIGHT1.13 U1.7
PD15: RIGHT1.16 U1.30
PE0: RIGHT1.44 U1.44
PE2: LEFT1.44 U1.88
PE3: LEFT1.43 U1.66
PE4: LEFT1.42 U1.87
PE5: LEFT1.41 U1.65
PE6: LEFT1.40 U1.86
PE7: LEFT1.22 U1.77
PE8: LEFT1.21 U1.55
PE9: LEFT1.20 U1.76
PE10: LEFT1.19 U1.54
PE11: LEFT1.18 U1.75
PE12: LEFT1.17 U1.53
PE13: LEFT1.16 U1.74
PE14: LEFT1.15 U1.52
PE15: LEFT1.14 U1.73
R1: RIGHT1.37 Trace  R L 5v G.2 U1.19
R2: RIGHT1.35 Trace  R L 5v G.1 U1.18
RX1: RIGHT1.21 U1.11 U1_FeeTech 5v T R G.3
RX2: LEFT1.31 U1.60 U2_HWT 5v TX RX G.3
RX3: LEFT1.12 U1.72 USART3 T R G.2
RX5: RIGHT1.32 U1.38 UART5 Tx Rx G.2
RX6: RIGHT1.18 U1.31 USART6 T R G.2
TX1: RIGHT1.22 U1.33 U1_FeeTech 5v T R G.2
TX2: LEFT1.32 U1.82 U2_HWT 5v TX RX G.2
TX3: LEFT1.13 U1.51 USART3 T R G.1
TX5: RIGHT1.27 U1.14 UART5 Tx Rx G.1
TX6: RIGHT1.15 U1.8 USART6 T R G.1
VREF+: U1.70

Pads without a net: LEFT1 7 8

## Via types
v1: diameter 0.61, hole 0.305, Top Layer to Bottom Layer, 38 vias

## Routing (per net, layer and track width the routed paths; a pad name or vN(x,y) marks a point on that pad's centre or on a via; arc(x,y) is an arc through that point)
3.3V: length 203.5
  Top Layer w0.254: U1.45 U1.67 LEFT1.1 LEFT1.2 21.3,17.52
  Top Layer w0.381: 3V1#2.1 90.51,39.11 88.48,37.08 88.48,30.73 84.93,27.17 3V1.1 ; U1.45 52.79,18.03 v1(54.32,19.55) ; 21.3,17.52 19.27,15.49 7.33,15.49 OLED.2 5.3,20.44 3V2.1 ; 3V1.1 80.35,10.92 Buzzer1 G GPIO 3v3.3 ; 3V1.1 90.13,10.28 Buzzer2.3 ; 3V3.1 9.36,62.48 v1(9.36,59.43) ; 62.83,20.57 U1.2 RIGHT1.4 RIGHT1.3 74,20.57 v1(75.15,19.43) ; +Red_Laser_3V3.1 8.72,52.06 +Blue_Laser_3V3.1 4.66,49.78 v1(4.28,49.4) ; H1.1 v1(88.48,43.05)
  Bottom Layer w0.381: U1.24 55.33,20.57 v1(54.32,19.55) ; v1(9.36,59.43) 7.32,57.39 7.32,53.98 8.34,52.95 +Red_Laser_3V3.1 ; v1(75.15,19.43) 77.31,17.27 83.15,17.27 3V1.1 ; v1(88.48,43.05) 92.42,39.11 3V1#2.1 ; 3V2.1 1.36,24.38 1.36,46.48 v1(4.28,49.4)
5V: length 259.8
  Top Layer w0.381: U2_HWT 5v TX RX G.1 10.82,38.22 ; Source.1 11.65,65.78 5V#3.1 14.44,62.1 +Red_Laser_5V.1 4.53,62.35 4.53,63.5 ; 62.06,4.57 62.06,4.69 65.88,8.5 65.88,17.52 ; 5V#4.1 87.47,38.48 87.47,31.08 76.8,20.41 5V#2.1 74.38,18.03 RIGHT1.1 RIGHT1.2 U1.1 62.83,18.03
  Top Layer w0.508: +Red_Laser_5V.1 9.61,57.14 10.87,55.89 10.87,38.22 10.82,38.22 11.91,37.13 11.91,25.03 5V.1
  Bottom Layer w0.508: 62.06,4.57 51.52,15.11 21.68,15.11 19.65,17.14 19.65,19.3 17.87,21.08 11.39,21.08 9.87,22.6 5V.1 ; U1_FeeTech 5v T R G.1 73.62,74.04 62.06,74.04 58.51,70.48 34.38,70.48 30.57,74.29 21.3,74.29 18,70.99 14.31,70.99 Source.1
GND: length 245.6
  Top Layer w0.254: LEFT1.5 LEFT1.3 LEFT1.4 LEFT1.6 ; U1.69 U1.47 U1.46 U1.68
  Top Layer w0.381: GND.3 GND.4 GND.5 GND.6 GND.7 ; GND.3 8.09,33.9 UART5 Tx Rx G.3 ; GND.3 GND.2 GND.1 5.3,26.92 3V2.2 5.68,22.98 7.45,21.2 10.63,21.2 5V.2 ; Buzzer1 G GPIO 3v3.1 77.69,5.2 83.78,5.2 85.05,6.47 Buzzer2.1 ; Buzzer1 G GPIO 3v3.1 67.65,7.62 64.6,4.57 ; Buzzer1 G GPIO 3v3.1 79.34,11.68 79.34,15.62 ; +Blue_Laser_5V.3 3.5,67.54 2.73,67.54 2.38,67.18 2.38,59.43 4.66,57.14 ; +Blue_Laser_5V.3 4.53,71.37 9.23,76.07 13.59,76.07 16.01,73.66 Source.2 16.73,67.81 5V#3.2 14.44,64.81 15.96,63.28 15.96,61.08 +Red_Laser_5V.2 +Red_Laser_3V3.2 ; +Blue_Laser_5V.3 7.58,65.53 3V3.2 ; 4.41,57.14 1.61,54.35 1.61,45.84 GND.7 ; GND.7 7.33,44.06 U2_HWT 5v TX RX G.4 ; USART3 T R G.3 95.21,23.24 3V1.2
  Bottom Layer w0.254: LEFT1.5 U1.69 ; 21.17,22.98 LEFT1.6 ; U1.25 U1.3 RIGHT1.6 RIGHT1.5
  Bottom Layer w0.381: OLED.1 3.01,17.78 3.01,20.7 3V2.2 ; 5V.2 21.17,22.98 ; U1.47 U1.25
BLUE_PWM: length 39.6
  Top Layer w0.254: 27.27,58.67 25.36,58.67 24.28,57.59 23.39,57.59 22.31,58.67 LEFT1.34 21.3,58.54
  Top Layer w0.381: v1(13.3,54.73) 15.46,54.73 16.85,56.13 18.89,56.13 21.3,58.54 ; v1(7.96,54.61) +Blue_Laser_3V3.2 6.25,56.19 6.25,57.34 4.79,58.8 4.15,58.8 3.14,59.81 3.14,64.64 +Blue_Laser_5V.2
  Bottom Layer w0.381: v1(7.96,54.61) 13.17,54.61 v1(13.3,54.73)
BUZZER1: length 72.8
  Top Layer w0.254: LEFT1.25 24.86,48.51 25.9,47.47 28.21,47.47 29.25,48.51 29.81,48.51
  Top Layer w0.381: U1.57 57.75,21.08 57.75,18.42 v1(57.76,18.41)
  Bottom Layer w0.381: v1(57.76,18.41) 66.78,9.39 76.03,9.39 Buzzer1 G GPIO 3v3.2
BUZZER2: length 87.9
  Top Layer w0.254: U1.78 28.41,45.97 29.81,47.37 30.7,47.37 ; LEFT1.24 22.31,45.97 23.39,47.05 24.66,47.05 25.74,45.97 27.27,45.97
  Top Layer w0.381: v1(57.6,17.37) 57.11,17.85 57.11,20.95 30.7,47.37
  Bottom Layer w0.381: Buzzer2.2 87.59,7.11 85.56,5.07 69.89,5.07 v1(57.6,17.37)
CAN_RX: length 34.1
  Top Layer w0.254: RIGHT1.24 68.03,45.97 66.99,44.93 64.94,44.93 63.9,45.97 62.83,45.97
  Top Layer w0.381: v1(86.58,46.98) v1(73.62,46.98)
  Bottom Layer w0.254: 71.08,47.11 RIGHT1.24
  Bottom Layer w0.381: v1(73.62,46.98) 73.5,47.11 71.08,47.11 ; H1.3 93.56,50.7 89.85,46.98 v1(86.58,46.98)
CAN_TX: length 33.8
  Top Layer w0.254: 65.37,45.97 67.53,45.97 68.6,47.05 70.39,47.05 71.47,45.97 RIGHT1.23
  Top Layer w0.381: RIGHT1.23 v1(87.08,45.97)
  Bottom Layer w0.381: v1(87.08,45.97) 90.26,45.97 95.47,51.18 H1.4
L1: length 76.9
  Top Layer w0.254: RIGHT1.41 71.47,68.83 70.39,69.91 68.22,69.91 67.15,68.83 65.37,68.83
  Top Layer w0.381: Trace  R L 5v G.4 56.99,8 60.41,11.43 v1(60.41,58.67) ; v1(60.41,61.34) v1(60.41,63.62)
  Bottom Layer w0.254: U1.21 64.48,67.43 62.83,67.43
  Bottom Layer w0.381: 62.83,67.43 60.41,65.02 v1(60.41,63.62) ; v1(60.41,58.67) v1(60.41,61.34)
L2: length 81
  Top Layer w0.254: 65.87,71.37 67.15,71.37 68.22,72.45 70.39,72.45 71.47,71.37 RIGHT1.43 ; 65.87,71.37 65.65,71.15 65.38,71.15 64.06,72.47 62.88,72.47 ; 65.87,71.37 65.37,71.37
  Top Layer w0.381: v1(61.27,64.16) 61.3,64.13 v1(61.3,61.84) ; 62.88,72.47 62.14,71.73 v1(62.14,65.73) ; v1(61.19,59.43) 61.19,10.68 59.53,9.01 Trace  R L 5v G.5
  Bottom Layer w0.381: v1(61.27,64.16) 62.14,65.03 v1(62.14,65.73) ; v1(61.3,61.84) 61.19,61.73 v1(61.19,59.43)
M: length 75.4
  Top Layer w0.254: RIGHT1.39 71.47,66.29 70.39,67.37 68.22,67.37 67.15,66.29 65.37,66.29
  Top Layer w0.381: 54.44,4.57 54.44,6.98 59.7,12.24 v1(59.7,58.08)
  Bottom Layer w0.381: U1.20 64.9,66.29 63.63,65.02 63.04,65.02 59.7,61.68 v1(59.7,58.08)
OLED_CS: length 39.4
  Top Layer w0.254: 27.27,48.51 25.36,48.51 24.28,49.59 23.39,49.59 22.31,48.51 LEFT1.26 21.04,48.51
  Top Layer w0.381: OLED.7 19.01,18.54 19.01,46.48 21.04,48.51
OLED_D0: length 56.3
  Top Layer w0.254: U1.59 29.27,54.63 25.51,54.63 24.47,53.59 LEFT1.29
  Top Layer w0.381: OLED.3 11.52,21.2 12.79,21.2 15.2,23.62 15.2,52.7 17.23,54.73 21.77,54.73 22.91,53.59 LEFT1.29
OLED_D1: length 49.1
  Top Layer w0.254: LEFT1.27 24.09,51.05 25.23,49.91 29.17,49.91 U1.58
  Top Layer w0.381: OLED.4 16.09,23.24 16.09,47.75 18.19,49.84 22.63,49.84 LEFT1.27
OLED_DC: length 45.3
  Top Layer w0.254: LEFT1.28 22.31,51.05 23.39,52.13 24.28,52.13 25.36,51.05 27.27,51.05
  Top Layer w0.381: OLED.6 18,20.06 v1(18,47.62) ; v1(18,50.8) 19.14,51.94 20.41,51.94 LEFT1.28
  Bottom Layer w0.381: v1(18,47.62) v1(18,50.8)
OLED_RES: length 47.7
  Top Layer w0.254: 27.27,53.59 25.36,53.59 24.28,52.51 23.39,52.51 22.31,53.59 LEFT1.30
  Top Layer w0.381: LEFT1.30 19.52,53.59 v1(16.73,50.8) ; OLED.5 16.98,21.59 16.98,46.48 v1(16.85,46.6)
  Bottom Layer w0.381: v1(16.73,50.8) 16.85,50.67 v1(16.85,46.6)
PA1: length 6.8
  Top Layer w0.254: LEFT1.33 24.86,58.67 25.9,59.71 28.26,59.71 29.3,58.67 29.81,58.67
PA8: length 8
  Top Layer w0.254: 65.37,40.89 67.53,40.89 68.6,41.97 70.39,41.97 71.47,40.89 RIGHT1.19
PA15: length 8
  Top Layer w0.254: 62.83,48.51 63.9,48.51 64.94,47.47 66.73,47.47 67.78,48.51 RIGHT1.26
PB1: length 7.1
  Top Layer w0.254: LEFT1.23 25.24,45.97 26.28,44.93 29.27,44.93 29.81,45.46 29.81,45.97
PB3: length 8
  Top Layer w0.254: RIGHT1.38 67.65,63.75 66.61,62.71 64.94,62.71 63.9,63.75 62.83,63.75
PB6: length 8
  Top Layer w0.254: RIGHT1.40 67.65,66.29 66.61,65.25 64.94,65.25 63.9,66.29 62.83,66.29
PB8: length 8
  Top Layer w0.254: 62.83,68.83 63.9,68.83 64.94,67.79 66.61,67.79 67.65,68.83 RIGHT1.42
PB12: length 7.1
  Top Layer w0.254: LEFT1.11 24.86,30.73 26.26,29.33 28.03,29.33 29.43,30.73 29.81,30.73
PB13: length 6.9
  Top Layer w0.254: LEFT1.10 22.35,28.19 22.76,28.6 22.76,28.64 23.39,29.27 24.28,29.27 25.36,28.19 27.27,28.19
PB14: length 6.9
  Top Layer w0.254: LEFT1.9 24.97,27.05 28.67,27.05 29.81,28.19
PB15: length 8
  Top Layer w0.254: RIGHT1.8 67.74,25.65 66.63,24.54 64.91,24.54 63.81,25.65 62.83,25.65
PC0: length 6.9
  Top Layer w0.254: 27.27,63.75 25.36,63.75 24.28,62.67 23.39,62.67 22.31,63.75 LEFT1.38
PC1: length 6.8
  Top Layer w0.254: 29.81,63.75 29.43,63.75 28.38,64.79 25.9,64.79 24.86,63.75 LEFT1.37
PC2: length 6.9
  Top Layer w0.254: 27.27,61.21 25.36,61.21 24.28,60.13 23.39,60.13 22.31,61.21 LEFT1.36
PC3: length 6.8
  Top Layer w0.254: LEFT1.35 24.86,61.21 25.9,62.25 28.26,62.25 29.3,61.21 29.81,61.21
PC8: length 8
  Top Layer w0.254: RIGHT1.17 71.47,38.35 70.39,39.43 68.6,39.43 67.53,38.35 65.37,38.35
PC9: length 8
  Top Layer w0.254: RIGHT1.20 68.03,40.89 66.99,39.85 64.94,39.85 63.9,40.89 62.83,40.89
PC10: length 8
  Top Layer w0.254: 65.37,48.51 67.27,48.51 68.35,49.59 70.39,49.59 71.02,48.96 71.02,48.92 71.43,48.51 RIGHT1.25
PC11: length 8
  Top Layer w0.254: RIGHT1.28 67.78,51.05 66.73,50.01 64.94,50.01 63.9,51.05 62.83,51.05
PC13: length 6.8
  Top Layer w0.254: 29.81,66.29 29.3,66.29 28.26,67.33 25.9,67.33 24.86,66.29 LEFT1.39
PD0: length 8
  Top Layer w0.254: RIGHT1.30 67.78,53.59 66.73,52.55 64.94,52.55 63.9,53.59 62.83,53.59
PD1: length 8
  Top Layer w0.254: RIGHT1.29 71.47,53.59 70.39,54.67 68.35,54.67 67.27,53.59 65.37,53.59
PD3: length 8
  Top Layer w0.254: 65.37,56.13 67.27,56.13 68.35,57.21 70.39,57.21 71.47,56.13 RIGHT1.31
PD4: length 8
  Top Layer w0.254: 62.83,58.67 63.9,58.67 64.94,57.63 66.31,57.63 67.35,58.67 RIGHT1.34
PD5: length 8
  Top Layer w0.254: 65.37,58.67 66.34,58.67 67.41,59.75 70.39,59.75 71.47,58.67 RIGHT1.33
PD6: length 8
  Top Layer w0.254: 62.83,61.21 63.9,61.21 64.94,60.17 66.61,60.17 67.65,61.21 RIGHT1.36
PD8: length 8.1
  Top Layer w0.254: 65.37,25.65 67.15,25.65 68.29,26.79 70.83,26.79 71.97,25.65 RIGHT1.7
PD9: length 8
  Top Layer w0.254: RIGHT1.10 67.52,28.19 66.48,27.15 64.94,27.15 63.9,28.19 62.83,28.19
PD10: length 8
  Top Layer w0.254: 65.37,28.19 67.02,28.19 68.1,29.27 70.39,29.27 71.47,28.19 RIGHT1.9
PD11: length 8
  Top Layer w0.254: RIGHT1.12 67.52,30.73 66.48,29.69 64.94,29.69 63.9,30.73 62.83,30.73
PD12: length 8
  Top Layer w0.254: RIGHT1.11 71.47,30.73 70.39,31.81 68.1,31.81 67.02,30.73 65.37,30.73
PD13: length 8
  Top Layer w0.254: 62.83,33.27 63.9,33.27 64.94,32.23 66.48,32.23 67.52,33.27 RIGHT1.14
PD14: length 8
  Top Layer w0.254: RIGHT1.13 71.47,33.27 70.39,34.35 68.1,34.35 67.02,33.27 65.37,33.27
PD15: length 8
  Top Layer w0.254: RIGHT1.16 67.52,35.81 66.48,34.77 64.94,34.77 63.9,35.81 62.83,35.81
PE0: length 8
  Top Layer w0.254: RIGHT1.44 67.65,71.37 66.61,70.33 64.94,70.33 63.9,71.37 62.83,71.37
PE2: length 7
  Top Layer w0.254: 27.27,71.37 27.14,71.24 25.36,71.24 24.28,70.16 23.39,70.16 22.31,71.24 21.42,71.24 LEFT1.44
PE3: length 6.8
  Top Layer w0.254: 29.81,71.37 29.43,71.37 28.38,72.41 25.9,72.41 24.86,71.37 LEFT1.43
PE4: length 6.9
  Top Layer w0.254: 27.27,68.83 25.36,68.83 24.28,67.75 23.39,67.75 22.31,68.83 LEFT1.42
PE5: length 6.8
  Top Layer w0.254: 29.81,68.83 29.3,68.83 28.26,69.87 25.9,69.87 24.86,68.83 LEFT1.41
PE6: length 6.9
  Top Layer w0.254: LEFT1.40 22.31,66.29 23.39,65.21 24.28,65.21 25.36,66.29 27.27,66.29
PE7: length 6.9
  Top Layer w0.254: 27.27,43.43 25.36,43.43 24.28,44.51 23.39,44.51 22.76,43.88 22.76,43.84 22.35,43.43 LEFT1.22
PE8: length 6.8
  Top Layer w0.254: LEFT1.21 24.86,43.43 25.9,42.39 28.26,42.39 29.3,43.43 29.81,43.43
PE9: length 6.9
  Top Layer w0.254: LEFT1.20 22.38,39.81 26.19,39.81 27.27,40.89
PE10: length 6.8
  Top Layer w0.254: LEFT1.19 24.86,40.89 25.9,41.93 28.26,41.93 29.3,40.89 29.81,40.89
PE11: length 6.9
  Top Layer w0.254: LEFT1.18 22.38,39.43 26.19,39.43 27.27,38.35
PE12: length 6.8
  Top Layer w0.254: 29.81,38.35 28.77,37.31 24.88,37.31 LEFT1.17
PE13: length 6.9
  Top Layer w0.254: 27.27,35.81 26.19,36.89 22.38,36.89 LEFT1.16
PE14: length 6.8
  Top Layer w0.254: LEFT1.15 24.88,34.77 28.77,34.77 29.81,35.81
PE15: length 6.9
  Top Layer w0.254: LEFT1.14 22.38,34.35 26.19,34.35 27.27,33.27
R1: length 78
  Top Layer w0.254: RIGHT1.37 71.47,63.75 70.39,64.83 68.22,64.83 67.15,63.75 65.37,63.75
  Top Layer w0.381: v1(59.05,57.4) 59.02,57.36 59.02,12.95 51.91,5.84 Trace  R L 5v G.2 ; 65.81,63.75 64.67,64.89 59.91,64.89 59.14,64.13 v1(59.14,64)
  Bottom Layer w0.381: v1(59.05,57.4) 59.05,63.91 v1(59.14,64)
R2: length 74.3
  Top Layer w0.254: RIGHT1.35 71.47,61.21 70.39,62.29 68.22,62.29 67.15,61.21 65.24,61.21 64.14,62.31 62.88,62.31
  Top Layer w0.381: 62.88,62.31 58.41,57.84 58.41,13.61 Trace  R L 5v G.1
RX1: length 42.2
  Top Layer w0.254: 65.37,43.43 67.53,43.43 68.6,44.51 70.39,44.51 71.47,43.43 RIGHT1.21
  Top Layer w0.381: U1_FeeTech 5v T R G.3 v1(79.08,71.5) ; v1(79.08,66.8) v1(79.08,49.27)
  Bottom Layer w0.381: v1(79.08,71.5) v1(79.08,66.8) ; RIGHT1.21 73.24,43.43 v1(79.08,49.27)
RX2: length 29
  Top Layer w0.254: U1.60 29.34,56.13 28.3,55.09 25.81,55.09 24.77,56.13 LEFT1.31
  Top Layer w0.381: v1(22.57,54.98) 22.69,54.98 LEFT1.31 ; U2_HWT 5v TX RX G.3 v1(10.16,44.36)
  Bottom Layer w0.381: v1(10.16,44.36) 10.22,44.29 12,44.29 15.95,48.24 15.95,50.91 16.08,51.04 16.08,51.06 16.46,51.44 16.48,51.44 20.02,54.98 v1(22.57,54.98)
RX3: length 75.1
  Top Layer w0.254: LEFT1.12 22.35,30.73 22.76,31.14 22.76,31.18 23.39,31.81 24.28,31.81 25.36,30.73 27.27,30.73
  Bottom Layer w0.381: USART3 T R G.2 92.19,27.3 89.89,25 79.73,25 79.57,25.17 79.52,25.17 75.35,29.33 29.17,29.33 U1.72
RX5: length 77.6
  Top Layer w0.254: RIGHT1.32 67.78,56.13 66.73,55.09 64.94,55.09 63.9,56.13 62.83,56.13 ; UART5 Tx Rx G.2 v1(9.87,31.62)
  Bottom Layer w0.254: 62.83,56.13 43.52,56.13 32.28,44.89 14.5,44.89 11.29,41.68 11.29,33.17 9.87,31.75 v1(9.87,31.62)
RX6: length 36.6
  Top Layer w0.254: RIGHT1.18 68.03,38.35 66.99,37.31 64.94,37.31 63.9,38.35 62.83,38.35
  Top Layer w0.381: USART6 T R G.2 92.54,32.13 v1(88.74,28.32)
  Bottom Layer w0.381: RIGHT1.18 70.45,38.35 71.59,37.21 73.5,37.21 82.38,28.32 v1(88.74,28.32)
TX1: length 44.1
  Top Layer w0.254: RIGHT1.22 68.03,43.43 66.99,42.39 64.94,42.39 63.9,43.43 62.83,43.43
  Bottom Layer w0.254: 71.34,44.7 70.07,43.43 RIGHT1.22
  Bottom Layer w0.381: 76.54,74.42 76.54,74.29 77.94,72.89 77.94,49.27 73.37,44.7 71.34,44.7
TX2: length 29.4
  Top Layer w0.254: 27.27,56.13 25.36,56.13 24.28,57.21 23.39,57.21 22.31,56.13 LEFT1.32
  Top Layer w0.381: v1(11.77,43.3) 14.57,46.1 14.57,52.95 16.98,55.37 20.54,55.37 LEFT1.32 ; U2_HWT 5v TX RX G.2 v1(10.12,41.78)
  Bottom Layer w0.381: v1(10.12,41.78) 11.65,43.3 v1(11.77,43.3)
TX3: length 70.5
  Top Layer w0.254: LEFT1.13 24.88,32.23 28.77,32.23 29.81,33.27
  Top Layer w0.381: USART3 T R G.1 88.48,25.65 v1(88.23,25.65)
  Bottom Layer w0.381: U1.51 31.65,31.94 73.43,31.94 79.72,25.65 v1(88.23,25.65)
TX5: length 85.1
  Top Layer w0.254: 65.37,51.05 67.27,51.05 68.35,52.13 70.39,52.13 71.02,51.5 71.02,51.46 71.43,51.05 RIGHT1.27
  Top Layer w0.381: UART5 Tx Rx G.1 v1(10,28.06)
  Bottom Layer w0.254: v1(10,28.06) 10,28.44 11.65,30.09 11.65,41.53 14.63,44.51 24.28,44.51 24.32,44.47 30.75,44.47 30.77,44.44 32.34,44.44 43.26,55.37 59.27,55.37 62.45,52.19 64.73,52.19 65.62,51.3 65.37,51.05
TX6: length 32.1
  Top Layer w0.254: 65.37,35.81 67.02,35.81 68.1,36.89 70.39,36.89 71.47,35.81 RIGHT1.15
  Top Layer w0.381: v1(86.45,27.3) 90,30.86 USART6 T R G.1
  Bottom Layer w0.381: RIGHT1.15 80.99,27.3 v1(86.45,27.3)

## Copper pours and planes (outline as drawn; the poured copper is in the pictures)
GND on Top Layer: -8.17,89.4 110.96,89.4 110.96,-2.29 -8.17,-2.29
GND on Bottom Layer: -7.91,89.4 110.96,89.4 110.96,-2.29 -7.91,-2.29
GND on Bottom Layer: -7.78,89.53 110.71,89.53 110.71,-2.29 -7.78,-2.29

Small or netless copper shapes (teardrops, artwork), in the pictures only: 1 on Bottom Layer
